# EAGLE schematic wiring_diagram (EAGLE 6.2)
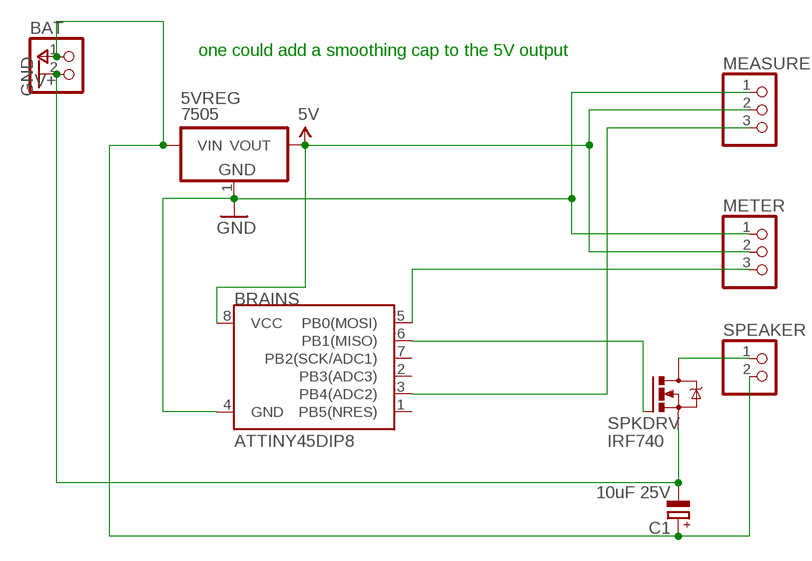
[diagram p0: schematic, sheet 1]

## Parts
5VREG  7505  IC_VREG_3PINS-TO-220  [TO-220V]
BAT  PINHD-1X2  [1X02]
BRAINS  ATTINY45DIP8  [DIP08]
C1  10uF 25V  CPOL-EUE2-4  [E2-4]
MEASURE  PINHD-1X3  [1X03]
METER  PINHD-1X3  [1X03]
SPEAKER  PINHD-1X2  [1X02]
SPKDRV  IRF740  [TO220BV]

## Nets
5V: 5VREG.2(VOUT) BRAINS.8(VCC) MEASURE.2 METER.2
GND: 5VREG.1(GND) BAT.2 BRAINS.4(GND) C1.- MEASURE.1 METER.1 SPKDRV.S
N$1: BRAINS.3(PB4(ADC2)) MEASURE.3
N$2: BRAINS.5(PB0(MOSI)) METER.3
N$3: SPEAKER.1 SPKDRV.D
N$5: BRAINS.6(PB1(MISO)) SPKDRV.G
V+: 5VREG.3(VIN) BAT.1 C1.+ SPEAKER.2
Unconnected: BRAINS.1(PB5(NRES)) BRAINS.2(PB3(ADC3)) BRAINS.7(PB2(SCK/ADC1))

## Notes on the sheet
- one could add a smoothing cap to the 5V output

## Library data of the parts
5VREG = dp_devices:IC_VREG_3PINS: Various 3 pin voltage regulators in different packages Double check the right pinout for the right part
BAT SPEAKER = pinhead:PINHD-1X2: PIN HEADER
BRAINS = SparkFun-DigitalIC:ATTINY45: Atmel 8-pin 2/4/8kB flash uC
C1 = rcl:CPOL-EU: POLARIZED CAPACITOR, European symbol
MEASURE METER = pinhead:PINHD-1X3: PIN HEADER
SPKDRV = transistor-power:IRF740: N-CHANNEL MOS FET